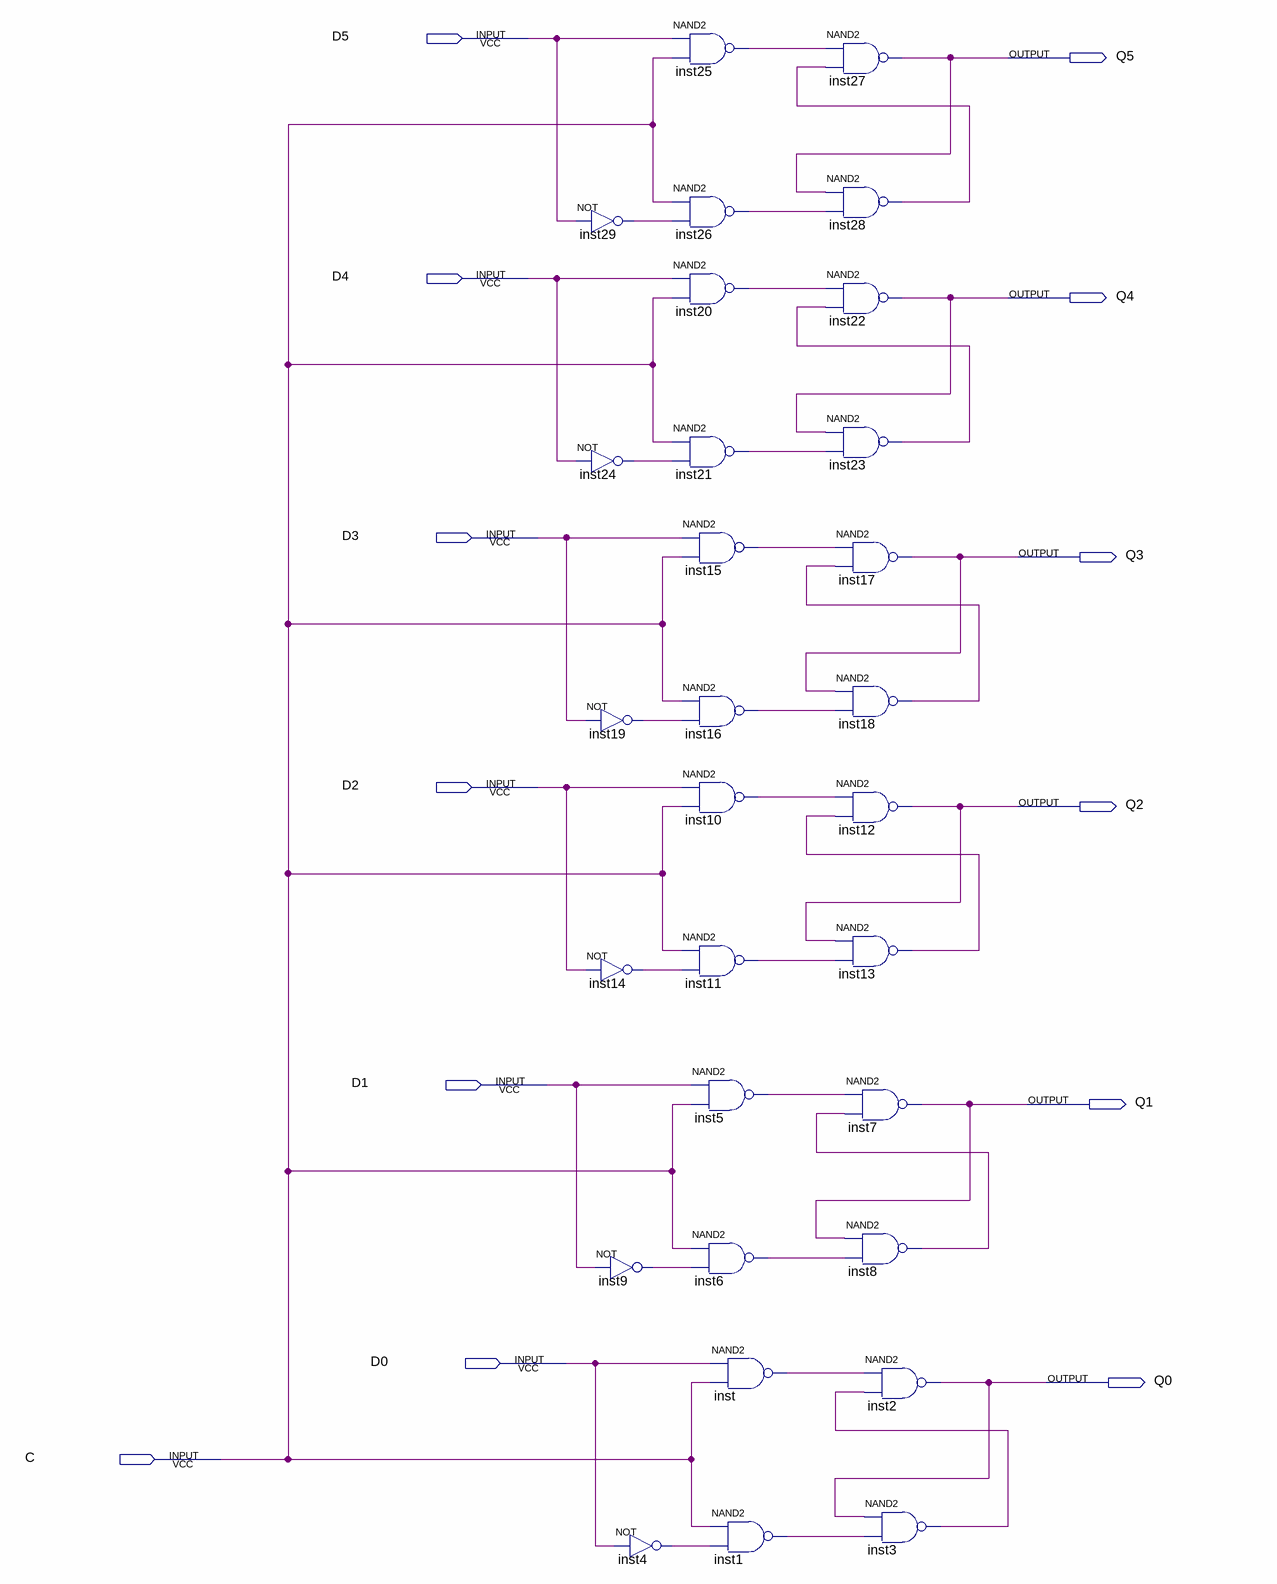
[diagram p0: schematic sheet]
// Quartus schematic ham_D_Latch.bdf as structural Verilog: 30 symbols, 13 pins
module ham_D_Latch (
  input  D5,
  input  D4,
  input  D3,
  input  D2,
  input  D1,
  input  D0,
  input  C,
  output Q5,
  output Q4,
  output Q3,
  output Q2,
  output Q1,
  output Q0
);

  wire inst1_out, inst3_out, inst4_out, inst5_out, inst6_out, inst8_out, inst9_out, inst10_out, inst11_out,
       inst13_out, inst14_out, inst15_out, inst16_out, inst18_out, inst19_out, inst20_out, inst21_out,
       inst23_out, inst24_out, inst25_out, inst26_out, inst28_out, inst29_out, inst_out;

  not inst29 (inst29_out, D5);
  not inst24 (inst24_out, D4);
  not inst19 (inst19_out, D3);
  not inst14 (inst14_out, D2);
  not inst9 (inst9_out, D1);
  not inst4 (inst4_out, D0);
  nand inst25 (inst25_out, D5, C);
  nand inst26 (inst26_out, C, inst29_out);
  nand inst20 (inst20_out, D4, C);
  nand inst21 (inst21_out, C, inst24_out);
  nand inst15 (inst15_out, D3, C);
  nand inst16 (inst16_out, C, inst19_out);
  nand inst10 (inst10_out, D2, C);
  nand inst11 (inst11_out, C, inst14_out);
  nand inst5 (inst5_out, D1, C);
  nand inst6 (inst6_out, C, inst9_out);
  nand inst (inst_out, D0, C);
  nand inst1 (inst1_out, C, inst4_out);
  nand inst27 (Q5, inst25_out, inst28_out);
  nand inst28 (inst28_out, Q5, inst26_out);
  nand inst22 (Q4, inst20_out, inst23_out);
  nand inst23 (inst23_out, Q4, inst21_out);
  nand inst17 (Q3, inst15_out, inst18_out);
  nand inst18 (inst18_out, Q3, inst16_out);
  nand inst12 (Q2, inst10_out, inst13_out);
  nand inst13 (inst13_out, Q2, inst11_out);
  nand inst7 (Q1, inst5_out, inst8_out);
  nand inst8 (inst8_out, Q1, inst6_out);
  nand inst2 (Q0, inst_out, inst3_out);
  nand inst3 (inst3_out, Q0, inst1_out);
endmodule
